# Altium project Day_2_Seminar.PrjPcb
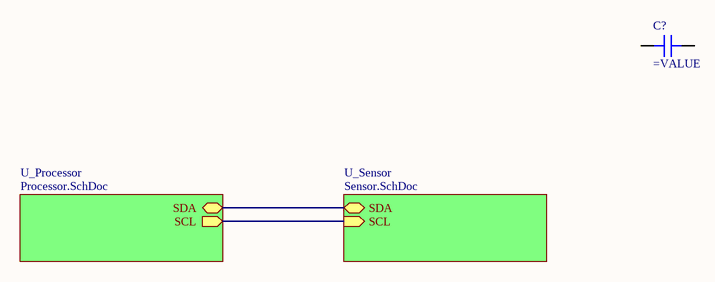
[diagram p0: Master.SchDoc]
3 sheets, 4 parts. Net scope: hierarchical (ports join the sheet entries above them; power ports are global).
Sheets:
  Master.SchDoc
    U_Sensor = Sensor.SchDoc
    U_Processor = Processor.SchDoc

## Sheet Master.SchDoc
size A4; Organization: WMG; Address1: University of Warwick; Address2: WM355; SheetNumber: 1; SheetTotal: 3

### Parts
C?  (no value)  [CAP 0201_0603]

### Sub-sheets
U_Processor = Processor.SchDoc: SDA (bidir), SCL (out)
U_Sensor = Sensor.SchDoc: SDA (bidir), SCL (in)

### Nets
NetIC1_23: sheet U_Sensor/SCL, sheet U_Processor/SCL
NetIC2_18: sheet U_Sensor/SDA, sheet U_Processor/SDA

Not connected (* = marked no-connect by the designer): C? 1 2

### Notes on the sheet
- Title
- Size:
- Date:
- A4
- Number:
- Time:
- Revision:
- Sheet
- of
- File:

### Library data of the parts
C? = Capacitor: SMT Capacitor

## Sheet Sensor.SchDoc
size A4; Organization: WMG; Address1: University of Warwick; Address2: WM355; SheetNumber: 2; SheetTotal: 3
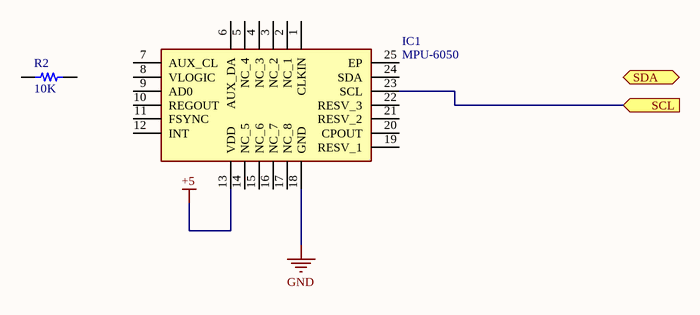
[diagram p1: Sensor.SchDoc]

### Parts
IC1  MPU-6050  [MPU6050]
R2  10K  [RES 0603_1608]

### Ports
SCL (in), SDA (bidir)

### Nets
+5: IC1.13(VDD)
GND: IC1.18(GND)
NetIC1_23: IC1.23(SCL) ; port SCL

Not connected (* = marked no-connect by the designer): IC1 1(CLKIN) 2(NC_1) 3(NC_2) 4(NC_3) 5(NC_4) 6(AUX_DA) 7(AUX_CL) 8(VLOGIC) 9(AD0) 10(REGOUT) 11(FSYNC) 12(INT) 14(NC_5) 15(NC_6) 16(NC_7) 17(NC_8) 19(RESV_1) 20(CPOUT) 21(RESV_2) 22(RESV_3) 24(SDA) 25(EP); R2 1 2

### Notes on the sheet
- Title
- Size:
- Date:
- A4
- Number:
- Time:
- Revision:
- Sheet
- of
- File:

### Library data of the parts
IC1 = MPU-6050: Integrated Circuit; Manufacturer_Name: TDK; Datasheet Link: https://invensense.tdk.com/wp-content/uploads/2015/02/MPU-6000-Datasheet1.pdf; Height: 0.95mm; Manufacturer_Part_Number: MPU-6050; Mouser Part Number: 410-MPU-6050; Mouser Price/Stock: https://www.mouser.co.uk/ProductDetail/TDK-InvenSense/MPU-6050?qs=u4fy%2FsgLU9O14B5JgyQFvg%3D%3D; Arrow Part Number: MPU-6050; Arrow Price/Stock: https://www.arrow.com/en/products/mpu-6050/invensense?region=nac
R2 = Resistor: SMT Resistor

## Sheet Processor.SchDoc
size A4; Organization: WMG; Address1: University of Warwick; Address2: WM355; SheetNumber: 3; SheetTotal: 3
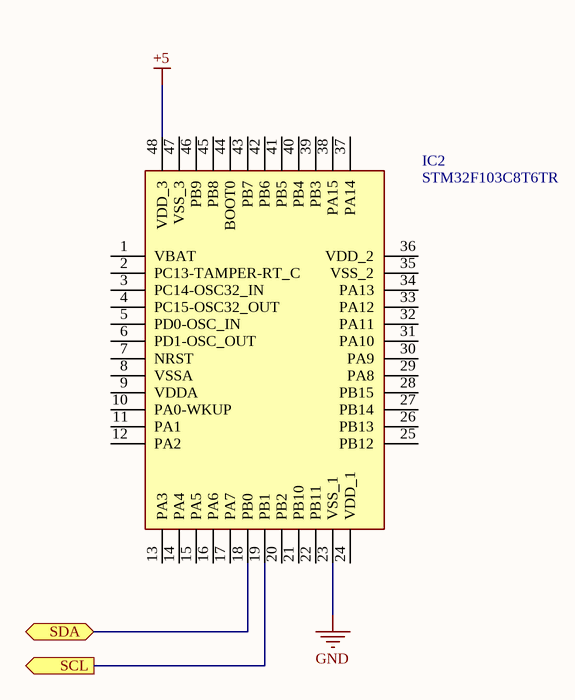
[diagram p2: Processor.SchDoc]

### Parts
IC2  STM32F103C8T6TR  [QFP50P900X900X160-48N]

### Ports
SCL (out), SDA (bidir)

### Nets
+5: IC2.48(VDD_3)
GND: IC2.23(VSS_1)
NetIC1_23: IC2.19(PB1) ; port SCL
NetIC2_18: IC2.18(PB0) ; port SDA

Not connected (* = marked no-connect by the designer): IC2 1(VBAT) 2(PC13-TAMPER-RT_C) 3(PC14-OSC32_IN) 4(PC15-OSC32_OUT) 5(PD0-OSC_IN) 6(PD1-OSC_OUT) 7(NRST) 8(VSSA) 9(VDDA) 10(PA0-WKUP) 11(PA1) 12(PA2) 13(PA3) 14(PA4) 15(PA5) 16(PA6) 17(PA7) 20(PB2) 21(PB10) 22(PB11) 24(VDD_1) 25(PB12) 26(PB13) 27(PB14) 28(PB15) 29(PA8) 30(PA9) 31(PA10) 32(PA11) 33(PA12) 34(PA13) 35(VSS_2) 36(VDD_2) 37(PA14) 38(PA15) 39(PB3) 40(PB4) 41(PB5) 42(PB6) 43(PB7) 44(BOOT0) 45(PB8) 46(PB9) 47(VSS_3)

### Notes on the sheet
- Title
- Size:
- Date:
- A4
- Number:
- Time:
- Revision:
- Sheet
- of
- File:

### Library data of the parts
IC2 = STM32F103C8T6TR: Integrated Circuit; Manufacturer_Name: STMicroelectronics; Datasheet Link: http://media.digikey.com/pdf/Data%20Sheets/ST%20Microelectronics%20PDFS/STM32F103x8,B.pdf; Height: 1.6mm; Manufacturer_Part_Number: STM32F103C8T6TR; Mouser Part Number: 511-STM32F103C8T6TR; Mouser Price/Stock: https://www.mouser.co.uk/ProductDetail/STMicroelectronics/STM32F103C8T6TR?qs=5HwTSiuA5HDxFj62n06yag%3D%3D; Arrow Part Number: STM32F103C8T6TR; Arrow Price/Stock: https://www.arrow.com/en/products/stm32f103c8t6tr/stmicroelectronics

## Nets that join several sheets
+5: Sensor (IC1.13), Processor (IC2.48)
GND: Sensor (IC1.18), Processor (IC2.23)
NetIC1_23: Sensor (IC1.23), Processor (IC2.19)